# Altium project PROC154E3_SCH.PrjPcb (part 47 of 60)
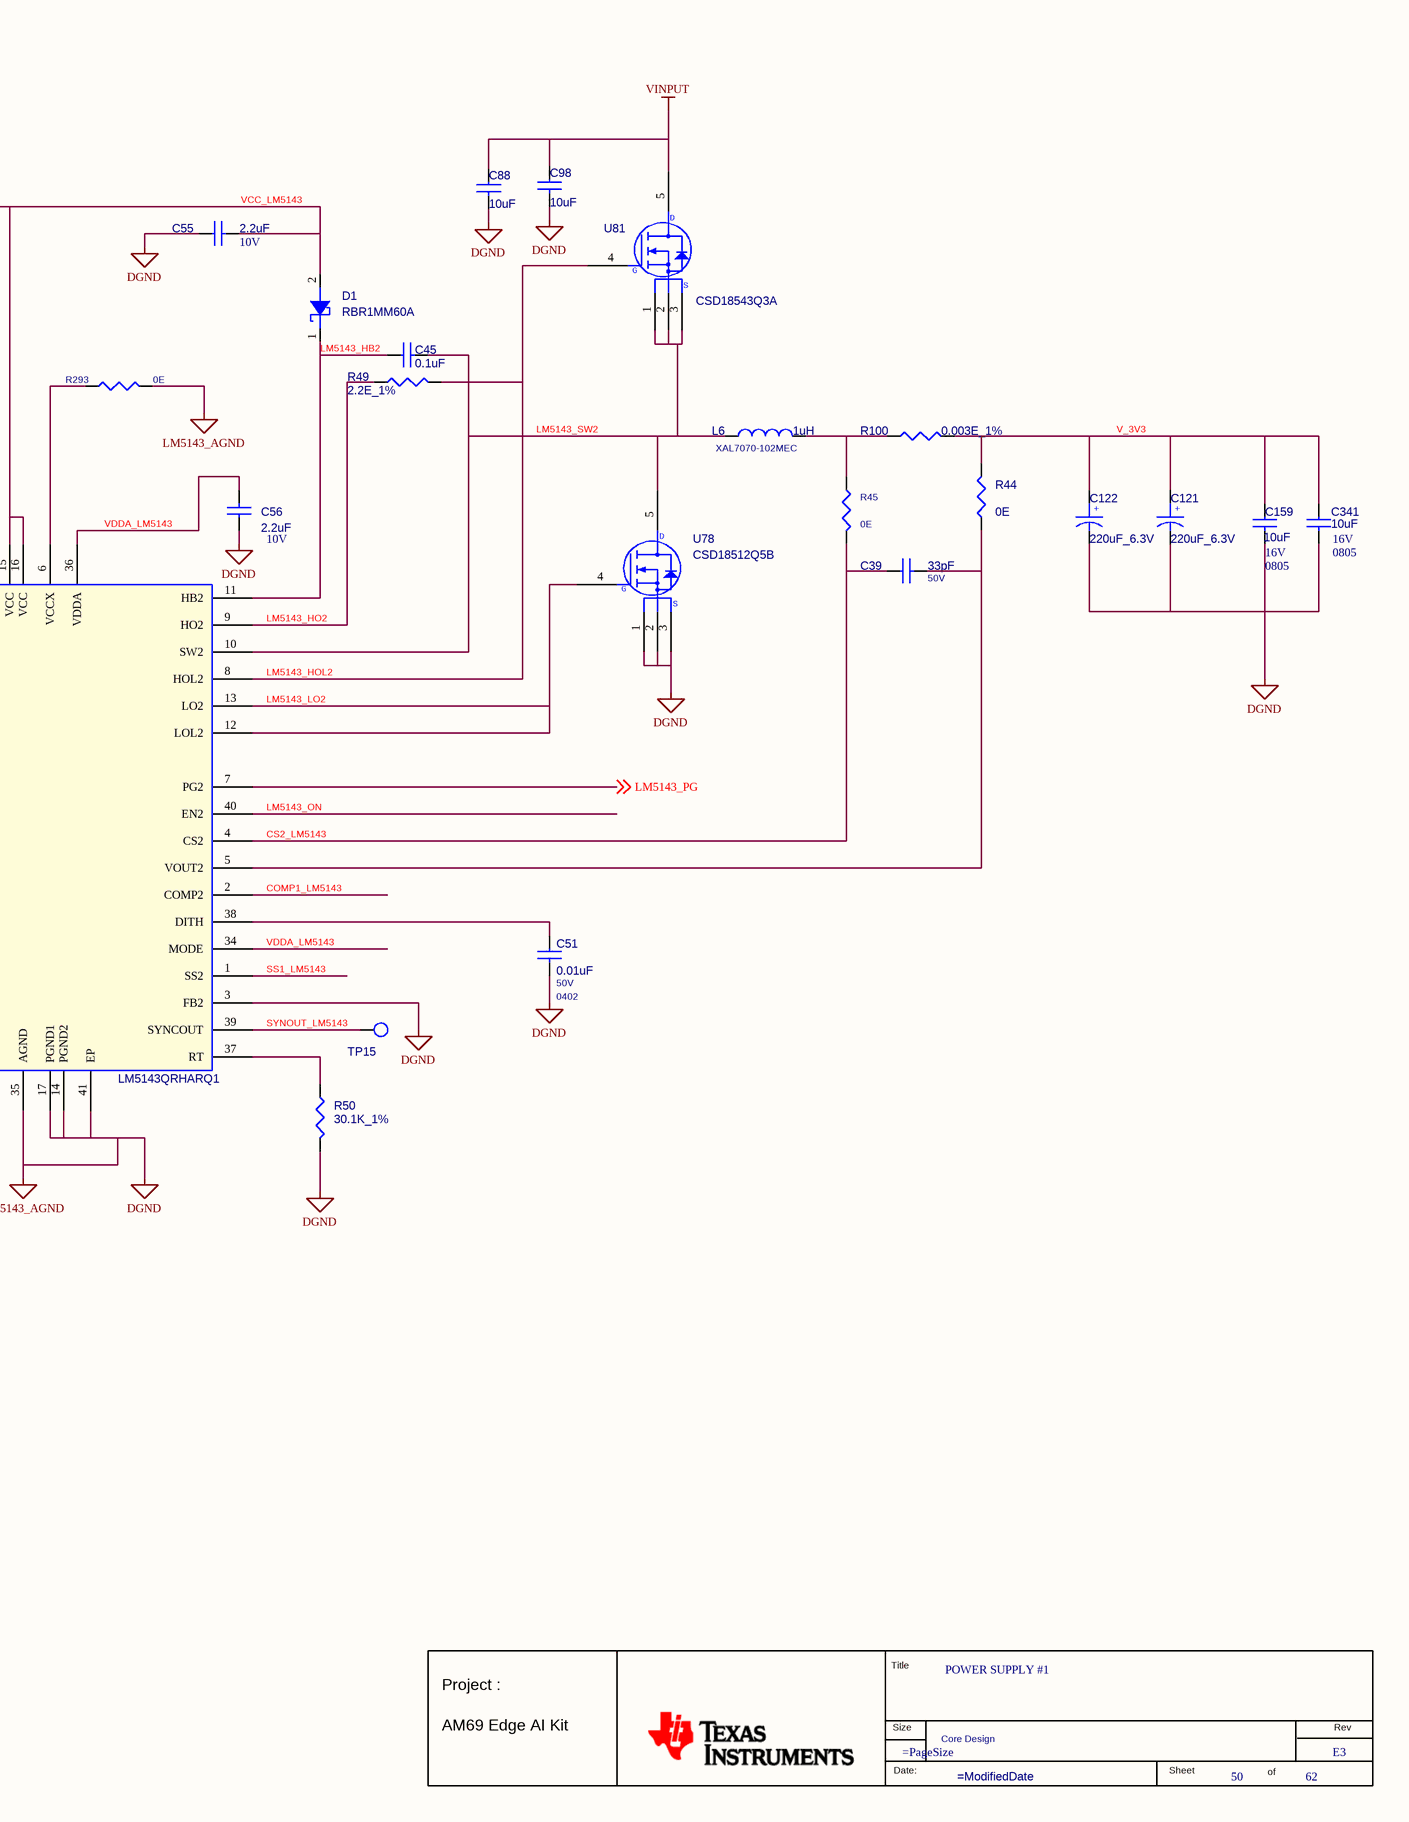
[diagram p185: 50. POWER SUPPLY #1.SchDoc, right]

## Sheet 50. POWER SUPPLY #1.SchDoc: POWER SUPPLY #1 (continued)

### Library data of the parts
*#50 = MISTRAL_TITLEBLK_CSIZE_1: as *#49 on sheet 49. POWER INPUT; Page Create Date: March  8, 1995; Page Size: =PageSize; Page Modify Date: =ModifiedDate; Schematic Page Count: 62; Schematic Page Number: 50
C36 = CAP_Dup1: CAP CERAMIC 1000pF 50V 5% C0G(NP0) 0402; Part Reference: C36; Part_type: CAPACITORS\CERAMIC; Mfr_part_number: 04025A102JAT2A; Mfr_name: AVX CORPORATION; Mistral Part No: 120016110009-R; Custom_Duty: 15%; Customs_HS_Code: 85322990; Wattage: NA; Project: BLR-3 PSPU; Value: 1000pF; PCB Footprint: CAP0402_0-75; Footprint Path: Y:\MIS_DATABASE\Library\ALTIUM_TOOL\PCB_FOOTPRINTS\Altium_Footprint_Lib.PcbLib; Library Path: Y:\MIS_DATABASE\Library\ALTIUM_TOOL\SCHEMATICS_PARTS\MS_DISCRETE_Library.schlib; MECHANICAL 3D STEP FILE: CAP0402_0-75; Chkd/date: VASANTHA/231216; Crtd /date: GEETHA/220906; Datasheet: Y:\MIS_DATABASE\DATASHEETS\CAPACITORS\AVX_MLC.PDF; Temperature: -55°C+125°C; Weight: 0.65mg; Height: 0.56MM; Library Ref: CAP; Distributor_part_number: 478-10070-1-ND; Distributor_name: DIGIKEY; Package: 0402; Voltage: 50V; Tolerance: 5%; Footprint Ref: CAP0402_0-75
C39 = CAP_Dup1: CAP CERAMIC 33pF 50V 5% C0G(NP0) 0402; Part Reference: C39; Mistral Part No: 120009030395-R; Mfr_name: MURATA; Mfr_part_number: GRM1555C1H330JZ01D; Part_type: CAPACITORS\CERAMIC; Project: ACRO_DM3730; Wattage: NA; Customs_HS_Code: 85322990; Custom_Duty: 15%; Value: 33pF; Footprint Path: Y:\MIS_DATABASE\Library\ALTIUM_TOOL\PCB_FOOTPRINTS\Altium_Footprint_Lib.PcbLib; Library Path: Y:\MIS_DATABASE\Library\ALTIUM_TOOL\SCHEMATICS_PARTS\MS_DISCRETE_Library.schlib; Footprint Ref: CAP0402_0-75; Tolerance: 5%; Package: 0402; Distributor_name: DIGIKEY; Distributor_part_number: 490-3220-1-ND; Library Ref: CAP; Height: 0.55MM; Weight: 6mg; Temperature: -55°C+125°C; Datasheet: Y:\MIS_DATABASE\DATASHEETS\CAPACITORS\MURATA-GXX-SER_NOV17.PDF; Crtd /date: BAVISH/080611; Chkd/date: NAVEED/260814; MECHANICAL 3D STEP FILE: CAP0402_0-75; Manufacturer: MURATA; PCB Footprint: CAP0402_0-75
C42 = CAP_Dup1: CAP CERAMIC 68pF 50V 5% C0G(NP0) 0402; Part Reference: C42; Mistral Part No: 120009050012-R; Mfr_name: KEMET; Mfr_part_number: C0402C680J5GACTU; Part_type: CAPACITORS\CERAMIC; Project: NARL_DRSP_4CH; Wattage: NA; Customs_HS_Code: 85322990; Custom_Duty: 15%; Value: 68pF; PCB Footprint: CAP0402_0-75; Footprint Ref: CAP0402_0-75; Tolerance: 5%; Voltage: 50V; Package: 0402; Distributor_name: DIGIKEY; Distributor_part_number: 399-7806-1-ND; Library Ref: CAP; Height: 0.55MM; Weight: 0.65mg; Temperature: -55°C+125°C; Datasheet: Y:\MIS_DATABASE\DATASHEETS\CAPACITORS\C0402C680J5GACTU.PDF; Crtd /date: MANIRAJA/210818; Chkd/date: MANIRAJA/210818; MECHANICAL 3D STEP FILE: CAP0402_0-75; Library Path: Y:\MIS_DATABASE\Library\ALTIUM_TOOL\SCHEMATICS_PARTS\MS_DISCRETE_Library.schlib; Footprint Path: Y:\MIS_DATABASE\Library\ALTIUM_TOOL\PCB_FOOTPRINTS\Altium_Footprint_Lib.PcbLib
C45 = CAP_Dup1: CAP CERAMIC 0.1uF 50V 10% X7R 0402; Part Reference: C45; Part_type: CAPACITORS\CERAMIC; Mfr_part_number: GRM155R71H104KE14D; Mfr_name: MURATA; Mistral Part No: 120011100014-R; Direct Alternate_mfr_name: TDK; Direct Alternate_mfr_part_number: C1005X7R1H104K050BE; Automotive Alternate_mfr_part_number: CGA2B3X7R1H104K050BB; Custom_Duty: 15%; Customs_HS_Code: 85322990; Wattage: NA; Project: J7_CP; Value: 0.1uF; Footprint Path: Y:\MIS_DATABASE\Library\ALTIUM_TOOL\PCB_FOOTPRINTS\Altium_Footprint_Lib.PcbLib; Library Path: Y:\MIS_DATABASE\Library\ALTIUM_TOOL\SCHEMATICS_PARTS\MS_DISCRETE_Library.schlib; MECHANICAL 3D STEP FILE: CAP0402_0-75; Chkd/date: MANIRAJA/261020; Crtd /date: ALVY/211020; Datasheet: Y:\MIS_DATABASE\DATASHEETS\CAPACITORS\GRM155R71H104KE14.PDF; Temperature: -55°C+125°C; Weight: 3.1mg; Height: 0.55MM; Distributor_part_number: 490-10700-1-ND; Distributor_name: DIGIKEY; Package: 0402; Voltage: 50V; Tolerance: 10%; Library Ref: CAP; Footprint Ref: CAP0402_0-75; Automotive Alternate_mfr_name: TDK; Manufacturer: MURATA; PCB Footprint: CAP0402_0-75
C51 = CAP_Dup1: CAP CERAMIC 0.01uF 50V 10% X7R 0402; Part Reference: C51; Mistral Part No: 120009030025-R; Mfr_name: KEMET; Mfr_part_number: C0402C103K5RACTU; Part_type: CAPACITORS\CERAMIC; Direct Alternate_mfr_name: TDK; Direct Alternate_mfr_part_number: C1005X7R1H103K050BE; Automotive Alternate_mfr_part_number: CGA2B3X7R1H103K050BB; Project: G4_SVGA; Customs_HS_Code: 85322990; Custom_Duty: 15%; Wattage: NA; Value: 0.01uF; PCB Footprint: CAP0402_0-75; Tolerance: 10%; Distributor_name: DIGIKEY; Distributor_part_number: 399-3066-1-ND; Library Ref: CAP; Height: 0.55MM; Datasheet: Y:\MIS_DATABASE\DATASHEETS\CAPACITORS\KEMET-C-X7R.PDF; Crtd /date: MAZHAR/040505; Chkd/date: SHREESHAIL/301105; Footprint Ref: CAP0402_0-75; Weight: 0.65mg; Temperature: -55°C+125°C; MECHANICAL 3D STEP FILE: CAP0402_0-75; Library Path: Y:\MIS_DATABASE\Library\ALTIUM_TOOL\SCHEMATICS_PARTS\MS_DISCRETE_Library.schlib; Footprint Path: Y:\MIS_DATABASE\Library\ALTIUM_TOOL\PCB_FOOTPRINTS\Altium_Footprint_Lib.PcbLib; Automotive Alternate_mfr_name: TDK
C55 = CAP_Dup1: CAP CERAMIC 2.2uF 10V 10% X7S 0603; Part Reference: C55; Mistral Part No: 120022090022-R; Mfr_name: MURATA; Mfr_part_number: GCM188C71A225KE01; Part_type: CAPACITORS\CERAMIC; Direct Alternate_mfr_name: YAGEO AMERICA; Direct Alternate_mfr_part_number: CC0402KRX5R7BB105; Automotive Alternate_mfr_name: TAIYO YUDEN; Automotive Alternate_mfr_part_number: EMK105BJ105KVHF; Manufacturer: TDK CORPORATION; Project: J7AHP_SK_BRD; Customs_HS_Code: 85322990; Custom_Duty: 15%; Wattage: NA; Value: 2.2uF; PCB Footprint: CAP0603_1; Tolerance: 10%; Package: 0603; Distributor_name: NA; Distributor_part_number: NA; Library Ref: CAP; Height: 0.90MM; Datasheet: Y:\MIS_DATABASE\DATASHEETS\CAPACITORS\GCM188C71A225KE01.PDF; Crtd /date: PRAVEEN/160922; Chkd/date: PRAVEEN/160922; Footprint Ref: CAP0603_1; Weight: 6.3mg; Temperature: -55°C+125°C; MECHANICAL 3D STEP FILE: CAP0603_1; Library Path: Y:\MIS_DATABASE\Library\ALTIUM_TOOL\SCHEMATICS_PARTS\MS_DISCRETE_Library.schlib; Footprint Path: Y:\MIS_DATABASE\Library\ALTIUM_TOOL\PCB_FOOTPRINTS\Altium_Footprint_Lib.PcbLib
C56 = CAP_Dup1: CAP CERAMIC 2.2uF 10V 10% X7S 0603; Part Reference: C56; Mistral Part No: 120022090022-R; Mfr_name: MURATA; Mfr_part_number: GCM188C71A225KE01; Part_type: CAPACITORS\CERAMIC; Direct Alternate_mfr_name: YAGEO AMERICA; Direct Alternate_mfr_part_number: CC0402KRX5R7BB105; Automotive Alternate_mfr_name: TAIYO YUDEN; Automotive Alternate_mfr_part_number: EMK105BJ105KVHF; Manufacturer: TDK CORPORATION; Project: J7AHP_SK_BRD; Customs_HS_Code: 85322990; Custom_Duty: 15%; Wattage: NA; Value: 2.2uF; PCB Footprint: CAP0603_1; Tolerance: 10%; Package: 0603; Distributor_name: NA; Distributor_part_number: NA; Library Ref: CAP; Height: 0.90MM; Datasheet: Y:\MIS_DATABASE\DATASHEETS\CAPACITORS\GCM188C71A225KE01.PDF; Crtd /date: PRAVEEN/160922; Chkd/date: PRAVEEN/160922; Footprint Ref: CAP0603_1; Weight: 6.3mg; Temperature: -55°C+125°C; MECHANICAL 3D STEP FILE: CAP0603_1; Library Path: Y:\MIS_DATABASE\Library\ALTIUM_TOOL\SCHEMATICS_PARTS\MS_DISCRETE_Library.schlib; Footprint Path: Y:\MIS_DATABASE\Library\ALTIUM_TOOL\PCB_FOOTPRINTS\Altium_Footprint_Lib.PcbLib
C57 = CAP_POL: CAP TANTALUM 220uF 6.3V 20% ESR 7mE V7343; Part Reference: C57; Part_type: CAPACITORS\TANTALUM; Mfr_part_number: T520V227M006ATE007; Mfr_name: KEMET; Mistral Part No: 120020100006-R; Custom_Duty: 15%; Customs_HS_Code: 85322990; Wattage: NA; Project: VAGG_SBC_BRD; Value: 220uF_6.3V; PCB Footprint: CAPT7343V_2; Footprint Path: Y:\MIS_DATABASE\Library\ALTIUM_TOOL\PCB_FOOTPRINTS\Altium_Footprint_Lib.PcbLib; Library Path: Y:\MIS_DATABASE\Library\ALTIUM_TOOL\SCHEMATICS_PARTS\MS_DISCRETE_Library.schlib; MECHANICAL 3D STEP FILE: CAPT7343V_2; Chkd/date: MANIRAJA/081020; Crtd /date: ALVY/081020; Datasheet: Y:\MIS_DATABASE\DATASHEETS\CAPACITORS\KEMET_T52X,530_MAY18.PDF; Temperature: -55°C+105°C; Weight: 274.3mg; Height: 1.90MM; Library Ref: CAP_POL; Distributor_part_number: 399-4659-1-ND; Distributor_name: DIGIKEY; Package: V7343; Voltage: 6.3V; Tolerance: 20%; Footprint Ref: CAPT7343V_2
C58 = CAP_POL: CAP TANTALUM 220uF 6.3V 20% ESR 7mE V7343; Part Reference: C58; Part_type: CAPACITORS\TANTALUM; Mfr_part_number: T520V227M006ATE007; Mfr_name: KEMET; Mistral Part No: 120020100006-R; Custom_Duty: 15%; Customs_HS_Code: 85322990; Wattage: NA; Project: VAGG_SBC_BRD; Value: 220uF_6.3V; PCB Footprint: CAPT7343V_2; Footprint Path: Y:\MIS_DATABASE\Library\ALTIUM_TOOL\PCB_FOOTPRINTS\Altium_Footprint_Lib.PcbLib; Library Path: Y:\MIS_DATABASE\Library\ALTIUM_TOOL\SCHEMATICS_PARTS\MS_DISCRETE_Library.schlib; MECHANICAL 3D STEP FILE: CAPT7343V_2; Chkd/date: MANIRAJA/081020; Crtd /date: ALVY/081020; Datasheet: Y:\MIS_DATABASE\DATASHEETS\CAPACITORS\KEMET_T52X,530_MAY18.PDF; Temperature: -55°C+105°C; Weight: 274.3mg; Height: 1.90MM; Library Ref: CAP_POL; Distributor_part_number: 399-4659-1-ND; Distributor_name: DIGIKEY; Package: V7343; Voltage: 6.3V; Tolerance: 20%; Footprint Ref: CAPT7343V_2
C59 = CAP_Dup1: CAP CERAMIC 2.2uF 10V 10% X7S 0603; Part Reference: C59; Part_type: CAPACITORS\CERAMIC; Mfr_part_number: GCM188C71A225KE01; Mfr_name: MURATA; Mistral Part No: 120022090022-R; Direct Alternate_mfr_name: YAGEO AMERICA; Direct Alternate_mfr_part_number: CC0402KRX5R7BB105; Automotive Alternate_mfr_name: TAIYO YUDEN; Automotive Alternate_mfr_part_number: EMK105BJ105KVHF; Manufacturer: TDK CORPORATION; Custom_Duty: 15%; Customs_HS_Code: 85322990; Project: J7AHP_SK_BRD; Wattage: NA; Value: 2.2uF; PCB Footprint: CAP0603_1; Chkd/date: PRAVEEN/160922; Crtd /date: PRAVEEN/160922; Datasheet: Y:\MIS_DATABASE\DATASHEETS\CAPACITORS\GCM188C71A225KE01.PDF; Height: 0.90MM; Library Ref: CAP; Distributor_part_number: NA; Distributor_name: NA; Package: 0603; Tolerance: 10%; Footprint Ref: CAP0603_1; Weight: 6.3mg; Temperature: -55°C+125°C; MECHANICAL 3D STEP FILE: CAP0603_1; Library Path: Y:\MIS_DATABASE\Library\ALTIUM_TOOL\SCHEMATICS_PARTS\MS_DISCRETE_Library.schlib; Footprint Path: Y:\MIS_DATABASE\Library\ALTIUM_TOOL\PCB_FOOTPRINTS\Altium_Footprint_Lib.PcbLib
C60 = CAP_Dup1: CAP CERAMIC 1uF 10V 10% X7S AUTO 0402; Part Reference: C60; Manufacturer: TDK CORPORATION; Automotive Alternate_mfr_part_number: EMK105BJ105KVHF; Automotive Alternate_mfr_name: TAIYO YUDEN; Direct Alternate_mfr_part_number: CC0402KRX5R7BB105; Direct Alternate_mfr_name: YAGEO AMERICA; Part_type: CAPACITORS\CERAMIC; Mfr_part_number: GCM155C71A105KE38D; Mfr_name: MURATA; Mistral Part No: 120018090021-R; Custom_Duty: 15%; Customs_HS_Code: 85322990; Wattage: NA; Project: SMART-M_SCRIPTALK_PB; Value: 1uF; PCB Footprint: CAP0402_0-75; MECHANICAL 3D STEP FILE: CAP0402_0-75; Library Ref: CAP; Chkd/date: MANIRAJA/100918; Crtd /date: ALVY/100918; Datasheet: Y:\MIS_DATABASE\DATASHEETS\CAPACITORS\MURATA-GCM-SER.PDF; Temperature: -55°C+125°C; Weight: 6mg; Height: 0.70MM; Distributor_part_number: 490-13409-1-ND; Distributor_name: DIGIKEY; Package: 0402; Tolerance: 10%; Footprint Ref: CAP0402_0-75; Library Path: Y:\MIS_DATABASE\Library\ALTIUM_TOOL\SCHEMATICS_PARTS\MS_DISCRETE_Library.schlib; Footprint Path: Y:\MIS_DATABASE\Library\ALTIUM_TOOL\PCB_FOOTPRINTS\Altium_Footprint_Lib.PcbLib
C62 = CAP_Dup1: CAP CERAMIC 33pF 50V 5% C0G(NP0) 0402; Part Reference: C62; Part_type: CAPACITORS\CERAMIC; Mfr_part_number: GRM1555C1H330JZ01D; Mfr_name: MURATA; Mistral Part No: 120009030395-R; Custom_Duty: 15%; Customs_HS_Code: 85322990; Wattage: NA; Project: ACRO_DM3730; Value: 33pF; MECHANICAL 3D STEP FILE: CAP0402_0-75; Chkd/date: NAVEED/260814; Crtd /date: BAVISH/080611; Datasheet: Y:\MIS_DATABASE\DATASHEETS\CAPACITORS\MURATA-GXX-SER_NOV17.PDF; Temperature: -55°C+125°C; Weight: 6mg; Height: 0.55MM; Library Ref: CAP; Distributor_part_number: 490-3220-1-ND; Distributor_name: DIGIKEY; Package: 0402; Tolerance: 5%; Footprint Ref: CAP0402_0-75; Library Path: Y:\MIS_DATABASE\Library\ALTIUM_TOOL\SCHEMATICS_PARTS\MS_DISCRETE_Library.schlib; Footprint Path: Y:\MIS_DATABASE\Library\ALTIUM_TOOL\PCB_FOOTPRINTS\Altium_Footprint_Lib.PcbLib; Manufacturer: MURATA; PCB Footprint: CAP0402_0-75
C63 = CAP_Dup1: CAP CERAMIC 0.1uF 50V 10% X7R 0402; Part Reference: C63; Manufacturer: MURATA; Mistral Part No: 120011100014-R; Mfr_part_number: GRM155R71H104KE14D; Part_type: CAPACITORS\CERAMIC; Direct Alternate_mfr_name: TDK; Direct Alternate_mfr_part_number: C1005X7R1H104K050BE; Automotive Alternate_mfr_part_number: CGA2B3X7R1H104K050BB; Project: J7_CP; Wattage: NA; Customs_HS_Code: 85322990; Custom_Duty: 15%; Value: 0.1uF; PCB Footprint: CAP0402_0-75; Footprint Ref: CAP0402_0-75; Library Ref: CAP; Mfr_name: MURATA; Tolerance: 10%; Package: 0402; Distributor_name: DIGIKEY; Distributor_part_number: 490-10700-1-ND; Height: 0.55MM; Weight: 3.1mg; Temperature: -55°C+125°C; Datasheet: Y:\MIS_DATABASE\DATASHEETS\CAPACITORS\GRM155R71H104KE14.PDF; Crtd /date: ALVY/211020; Chkd/date: MANIRAJA/261020; MECHANICAL 3D STEP FILE: CAP0402_0-75; Library Path: Y:\MIS_DATABASE\Library\ALTIUM_TOOL\SCHEMATICS_PARTS\MS_DISCRETE_Library.schlib; Footprint Path: Y:\MIS_DATABASE\Library\ALTIUM_TOOL\PCB_FOOTPRINTS\Altium_Footprint_Lib.PcbLib; Automotive Alternate_mfr_name: TDK
C64 = CAP_Dup1: CAP CERAMIC 0.1uF 50V 10% X7R 0402; Part Reference: C64; Part_type: CAPACITORS\CERAMIC; Mfr_part_number: GRM155R71H104KE14D; Manufacturer: MURATA; Mistral Part No: 120011100014-R; Custom_Duty: 15%; Customs_HS_Code: 85322990; Wattage: NA; Project: J7_CP; Value: 0.1uF; PCB Footprint: CAP0402_0-75; Footprint Path: Y:\MIS_DATABASE\Library\ALTIUM_TOOL\PCB_FOOTPRINTS\Altium_Footprint_Lib.PcbLib; Library Path: Y:\MIS_DATABASE\Library\ALTIUM_TOOL\SCHEMATICS_PARTS\MS_DISCRETE_Library.schlib; MECHANICAL 3D STEP FILE: CAP0402_0-75; Chkd/date: MANIRAJA/261020; Crtd /date: ALVY/211020; Datasheet: Y:\MIS_DATABASE\DATASHEETS\CAPACITORS\GRM155R71H104KE14.PDF; Temperature: -55°C+125°C; Weight: 3.1mg; Height: 0.55MM; Library Ref: CAP; Distributor_part_number: 490-10700-1-ND; Distributor_name: DIGIKEY; Package: 0402; Voltage: 50V; Tolerance: 10%; Footprint Ref: CAP0402_0-75; Mfr_name: MURATA
C75 = CAP_Dup1: CAP CERAMIC 10uF 50V 10% X7R 2220; Part Reference: C75; Part_type: CAPACITORS\CERAMIC; Mfr_part_number: C5750X7R1H106K; Mfr_name: TDK CORPORATION; Mistral Part No: 120009090017-R; Custom_Duty: 15%; Customs_HS_Code: 85322990; Wattage: NA; Project: ICD_DF_SYSTEM; Value: 10uF; PCB Footprint: CAP2220_2-5; Footprint Path: Y:\MIS_DATABASE\Library\ALTIUM_TOOL\PCB_FOOTPRINTS\Altium_Footprint_Lib.PcbLib; Library Path: Y:\MIS_DATABASE\Library\ALTIUM_TOOL\SCHEMATICS_PARTS\MS_DISCRETE_Library.schlib; MECHANICAL 3D STEP FILE: CAP2220_2-5; Chkd/date: RAGESH/270910; Crtd /date: MAZHAR/170909; Datasheet: Y:\MIS_DATABASE\DATASHEETS\CAPACITORS\TDK_C-SERIES.PDF; Temperature: -55°C+125°C; Weight: 480mg; Height: 2.50MM; Library Ref: CAP; Distributor_part_number: 445-3492-1-ND; Distributor_name: DIGIKEY; Package: 2220; Voltage: 50V; Tolerance: 10%; Footprint Ref: CAP2220_2-5
C76 = CAP_Dup1: CAP CERAMIC 10uF 50V 10% X7R 2220; Part Reference: C76; Mistral Part No: 120009090017-R; Mfr_name: TDK CORPORATION; Mfr_part_number: C5750X7R1H106K; Part_type: CAPACITORS\CERAMIC; Project: ICD_DF_SYSTEM; Wattage: NA; Customs_HS_Code: 85322990; Custom_Duty: 15%; Value: 10uF; PCB Footprint: CAP2220_2-5; Footprint Ref: CAP2220_2-5; Tolerance: 10%; Voltage: 50V; Package: 2220; Distributor_name: DIGIKEY; Distributor_part_number: 445-3492-1-ND; Library Ref: CAP; Height: 2.50MM; Weight: 480mg; Temperature: -55°C+125°C; Datasheet: Y:\MIS_DATABASE\DATASHEETS\CAPACITORS\TDK_C-SERIES.PDF; Crtd /date: MAZHAR/170909; Chkd/date: RAGESH/270910; MECHANICAL 3D STEP FILE: CAP2220_2-5; Library Path: Y:\MIS_DATABASE\Library\ALTIUM_TOOL\SCHEMATICS_PARTS\MS_DISCRETE_Library.schlib; Footprint Path: Y:\MIS_DATABASE\Library\ALTIUM_TOOL\PCB_FOOTPRINTS\Altium_Footprint_Lib.PcbLib
C88 = CAP_Dup1: CAP CERAMIC 10uF 50V 10% X7R 2220; Part Reference: C88; Part_type: CAPACITORS\CERAMIC; Mfr_part_number: C5750X7R1H106K; Mfr_name: TDK CORPORATION; Mistral Part No: 120009090017-R; Custom_Duty: 15%; Customs_HS_Code: 85322990; Wattage: NA; Project: ICD_DF_SYSTEM; Value: 10uF; PCB Footprint: CAP2220_2-5; Footprint Path: Y:\MIS_DATABASE\Library\ALTIUM_TOOL\PCB_FOOTPRINTS\Altium_Footprint_Lib.PcbLib; Library Path: Y:\MIS_DATABASE\Library\ALTIUM_TOOL\SCHEMATICS_PARTS\MS_DISCRETE_Library.schlib; MECHANICAL 3D STEP FILE: CAP2220_2-5; Chkd/date: RAGESH/270910; Crtd /date: MAZHAR/170909; Datasheet: Y:\MIS_DATABASE\DATASHEETS\CAPACITORS\TDK_C-SERIES.PDF; Temperature: -55°C+125°C; Weight: 480mg; Height: 2.50MM; Library Ref: CAP; Distributor_part_number: 445-3492-1-ND; Distributor_name: DIGIKEY; Package: 2220; Voltage: 50V; Tolerance: 10%; Footprint Ref: CAP2220_2-5
C98 = CAP_Dup1: CAP CERAMIC 10uF 50V 10% X7R 2220; Part Reference: C98; Part_type: CAPACITORS\CERAMIC; Mfr_part_number: C5750X7R1H106K; Mfr_name: TDK CORPORATION; Mistral Part No: 120009090017-R; Custom_Duty: 15%; Customs_HS_Code: 85322990; Wattage: NA; Project: ICD_DF_SYSTEM; Value: 10uF; PCB Footprint: CAP2220_2-5; Footprint Path: Y:\MIS_DATABASE\Library\ALTIUM_TOOL\PCB_FOOTPRINTS\Altium_Footprint_Lib.PcbLib; Library Path: Y:\MIS_DATABASE\Library\ALTIUM_TOOL\SCHEMATICS_PARTS\MS_DISCRETE_Library.schlib; MECHANICAL 3D STEP FILE: CAP2220_2-5; Chkd/date: RAGESH/270910; Crtd /date: MAZHAR/170909; Datasheet: Y:\MIS_DATABASE\DATASHEETS\CAPACITORS\TDK_C-SERIES.PDF; Temperature: -55°C+125°C; Weight: 480mg; Height: 2.50MM; Library Ref: CAP; Distributor_part_number: 445-3492-1-ND; Distributor_name: DIGIKEY; Package: 2220; Voltage: 50V; Tolerance: 10%; Footprint Ref: CAP2220_2-5
C121 = CAP_POL: CAP TANTALUM 220uF 6.3V 20% ESR 7mE V7343; Part Reference: C121; Mistral Part No: 120020100006-R; Mfr_name: KEMET; Mfr_part_number: T520V227M006ATE007; Part_type: CAPACITORS\TANTALUM; Project: VAGG_SBC_BRD; Wattage: NA; Customs_HS_Code: 85322990; Custom_Duty: 15%; Value: 220uF_6.3V; PCB Footprint: CAPT7343V_2; Footprint Ref: CAPT7343V_2; Tolerance: 20%; Voltage: 6.3V; Package: V7343; Distributor_name: DIGIKEY; Distributor_part_number: 399-4659-1-ND; Library Ref: CAP_POL; Height: 1.90MM; Weight: 274.3mg; Temperature: -55°C+105°C; Datasheet: Y:\MIS_DATABASE\DATASHEETS\CAPACITORS\KEMET_T52X,530_MAY18.PDF; Crtd /date: ALVY/081020; Chkd/date: MANIRAJA/081020; MECHANICAL 3D STEP FILE: CAPT7343V_2; Library Path: Y:\MIS_DATABASE\Library\ALTIUM_TOOL\SCHEMATICS_PARTS\MS_DISCRETE_Library.schlib; Footprint Path: Y:\MIS_DATABASE\Library\ALTIUM_TOOL\PCB_FOOTPRINTS\Altium_Footprint_Lib.PcbLib
C122 = CAP_POL: CAP TANTALUM 220uF 6.3V 20% ESR 7mE V7343; Part Reference: C122; Mistral Part No: 120020100006-R; Mfr_name: KEMET; Mfr_part_number: T520V227M006ATE007; Part_type: CAPACITORS\TANTALUM; Project: VAGG_SBC_BRD; Wattage: NA; Customs_HS_Code: 85322990; Custom_Duty: 15%; Value: 220uF_6.3V; PCB Footprint: CAPT7343V_2; Footprint Ref: CAPT7343V_2; Tolerance: 20%; Voltage: 6.3V; Package: V7343; Distributor_name: DIGIKEY; Distributor_part_number: 399-4659-1-ND; Library Ref: CAP_POL; Height: 1.90MM; Weight: 274.3mg; Temperature: -55°C+105°C; Datasheet: Y:\MIS_DATABASE\DATASHEETS\CAPACITORS\KEMET_T52X,530_MAY18.PDF; Crtd /date: ALVY/081020; Chkd/date: MANIRAJA/081020; MECHANICAL 3D STEP FILE: CAPT7343V_2; Library Path: Y:\MIS_DATABASE\Library\ALTIUM_TOOL\SCHEMATICS_PARTS\MS_DISCRETE_Library.schlib; Footprint Path: Y:\MIS_DATABASE\Library\ALTIUM_TOOL\PCB_FOOTPRINTS\Altium_Footprint_Lib.PcbLib
C158 = CAP_Dup1: CAP CERAMIC 10uF 16V 10% X5R 0805; Part Reference: C158; Manufacturer: MURATA; Automotive Alternate_mfr_part_number: GCM21BR71A106KE22L; Direct Alternate_mfr_part_number: CL21B106KPQNNNE; Direct Alternate_mfr_name: SAMSUNG; Part_type: CAPACITORS\CERAMIC; Mfr_part_number: GRM21BR61C106KE15L; Mistral Part No: 120009030205-R; Custom_Duty: 15%; Customs_HS_Code: 85322990; Project: VOCERA; Wattage: NA; Value: 10uF; PCB Footprint: CAP0805_1-5; Automotive Alternate_mfr_name: MURATA; Chkd/date: SHREESHAIL/220506; Crtd /date: MAZHAR/150506; Datasheet: Y:\MIS_DATABASE\DATASHEETS\CAPACITORS\MURATA-GXX-SER_NOV17.PDF; Temperature: -55°C+85°C; Weight: 9.5mg; Height: 1.35MM; Library Ref: CAP; Distributor_part_number: 490-3886-1-ND; Distributor_name: DIGIKEY; Tolerance: 10%; Mfr_name: MURATA; Footprint Ref: CAP0805_1-5; MECHANICAL 3D STEP FILE: CAP0805_1-5; Library Path: Y:\MIS_DATABASE\Library\ALTIUM_TOOL\SCHEMATICS_PARTS\MS_DISCRETE_Library.schlib; Footprint Path: Y:\MIS_DATABASE\Library\ALTIUM_TOOL\PCB_FOOTPRINTS\Altium_Footprint_Lib.PcbLib
C159 = CAP_Dup1: CAP CERAMIC 10uF 16V 10% X5R 0805; Part Reference: C159; Manufacturer: MURATA; Automotive Alternate_mfr_part_number: GCM21BR71A106KE22L; Direct Alternate_mfr_part_number: CL21B106KPQNNNE; Direct Alternate_mfr_name: SAMSUNG; Part_type: CAPACITORS\CERAMIC; Mfr_part_number: GRM21BR61C106KE15L; Mistral Part No: 120009030205-R; Custom_Duty: 15%; Customs_HS_Code: 85322990; Project: VOCERA; Wattage: NA; Value: 10uF; PCB Footprint: CAP0805_1-5; Automotive Alternate_mfr_name: MURATA; Chkd/date: SHREESHAIL/220506; Crtd /date: MAZHAR/150506; Datasheet: Y:\MIS_DATABASE\DATASHEETS\CAPACITORS\MURATA-GXX-SER_NOV17.PDF; Temperature: -55°C+85°C; Weight: 9.5mg; Height: 1.35MM; Library Ref: CAP; Distributor_part_number: 490-3886-1-ND; Distributor_name: DIGIKEY; Tolerance: 10%; Mfr_name: MURATA; Footprint Ref: CAP0805_1-5; MECHANICAL 3D STEP FILE: CAP0805_1-5; Library Path: Y:\MIS_DATABASE\Library\ALTIUM_TOOL\SCHEMATICS_PARTS\MS_DISCRETE_Library.schlib; Footprint Path: Y:\MIS_DATABASE\Library\ALTIUM_TOOL\PCB_FOOTPRINTS\Altium_Footprint_Lib.PcbLib
C341 = CAP_Dup1: CAP CERAMIC 10uF 16V 10% X5R 0805; Part Reference: C341; Manufacturer: MURATA; Automotive Alternate_mfr_part_number: GCM21BR71A106KE22L; Direct Alternate_mfr_part_number: CL21B106KPQNNNE; Direct Alternate_mfr_name: SAMSUNG; Part_type: CAPACITORS\CERAMIC; Mfr_part_number: GRM21BR61C106KE15L; Mistral Part No: 120009030205-R; Custom_Duty: 15%; Customs_HS_Code: 85322990; Project: VOCERA; Wattage: NA; Value: 10uF; PCB Footprint: CAP0805_1-5; Automotive Alternate_mfr_name: MURATA; Chkd/date: SHREESHAIL/220506; Crtd /date: MAZHAR/150506; Datasheet: Y:\MIS_DATABASE\DATASHEETS\CAPACITORS\MURATA-GXX-SER_NOV17.PDF; Temperature: -55°C+85°C; Weight: 9.5mg; Height: 1.35MM; Library Ref: CAP; Distributor_part_number: 490-3886-1-ND; Distributor_name: DIGIKEY; Tolerance: 10%; Mfr_name: MURATA; Footprint Ref: CAP0805_1-5; MECHANICAL 3D STEP FILE: CAP0805_1-5; Library Path: Y:\MIS_DATABASE\Library\ALTIUM_TOOL\SCHEMATICS_PARTS\MS_DISCRETE_Library.schlib; Footprint Path: Y:\MIS_DATABASE\Library\ALTIUM_TOOL\PCB_FOOTPRINTS\Altium_Footprint_Lib.PcbLib
C342 = CAP_Dup1: CAP CERAMIC 10uF 16V 10% X5R 0805; Part Reference: C342; Mistral Part No: 120009030205-R; Mfr_name: MURATA; Mfr_part_number: GRM21BR61C106KE15L; Part_type: CAPACITORS\CERAMIC; Direct Alternate_mfr_name: SAMSUNG; Direct Alternate_mfr_part_number: CL21B106KPQNNNE; Automotive Alternate_mfr_part_number: GCM21BR71A106KE22L; Wattage: NA; Project: VOCERA; Customs_HS_Code: 85322990; Custom_Duty: 15%; Value: 10uF; PCB Footprint: CAP0805_1-5; Footprint Path: Y:\MIS_DATABASE\Library\ALTIUM_TOOL\PCB_FOOTPRINTS\Altium_Footprint_Lib.PcbLib; Library Path: Y:\MIS_DATABASE\Library\ALTIUM_TOOL\SCHEMATICS_PARTS\MS_DISCRETE_Library.schlib; MECHANICAL 3D STEP FILE: CAP0805_1-5; Footprint Ref: CAP0805_1-5; Tolerance: 10%; Distributor_name: DIGIKEY; Distributor_part_number: 490-3886-1-ND; Library Ref: CAP; Height: 1.35MM; Weight: 9.5mg; Temperature: -55°C+85°C; Datasheet: Y:\MIS_DATABASE\DATASHEETS\CAPACITORS\MURATA-GXX-SER_NOV17.PDF; Crtd /date: MAZHAR/150506; Chkd/date: SHREESHAIL/220506; Automotive Alternate_mfr_name: MURATA; Manufacturer: MURATA
D1 = DIODE_SCHOTTKY: DIODE SCHOTTKY RECTIFIER 60V 1A SOD-123FL; Part Reference: D1; Part_type: DIODE\SCHOTTKY; Mfr_part_number: RBR1MM60ATR; Mfr_name: ROHM; Mistral Part No: 130022030051-R; Custom_Duty: 15%; Customs_HS_Code: 85412900; Wattage: NA; Project: TI_J7AHP_EVM_BRD; Value: RBR1MM60A; Footprint Path: Y:\MIS_DATABASE\Library\ALTIUM_TOOL\PCB_FOOTPRINTS\Altium_Footprint_Lib.PcbLib; Library Path: Y:\MIS_DATABASE\Library\ALTIUM_TOOL\SCHEMATICS_PARTS\MS_DISCRETE_Library.schlib; MECHANICAL 3D STEP FILE: DIO_SOD123F_0-9; Chkd/date: ALVY/240322; Crtd /date: TAMILARASU/220322; Datasheet: Y:\MIS_DATABASE\DATASHEETS\DISCRETES\DIODES\RBR1MM60A.PDF; Temperature: NA; Weight: 27.827mg; Height: 0.90MM; Library Ref: DIODE_SCHOTTKY; Distributor_part_number: RBR1MM60ACT-ND; Distributor_name: DIGIKEY; Package: SOD-123FL; Voltage: 60V; Tolerance: NA; Footprint Ref: DIO_SOD123F_0-9; Manufacturer: ROHM; PCB Footprint: DIO_SOD123F_0-9
D2 = DIODE_SCHOTTKY: DIODE SCHOTTKY RECTIFIER 60V 1A SOD-123FL; Part Reference: D2; Manufacturer: ROHM; Mistral Part No: 130022030051-R; Mfr_part_number: RBR1MM60ATR; Part_type: DIODE\SCHOTTKY; Project: TI_J7AHP_EVM_BRD; Tolerance: NA; Customs_HS_Code: 85412900; Custom_Duty: 15%; Value: RBR1MM60A; Footprint Ref: DIO_SOD123F_0-9; Mfr_name: ROHM; Voltage: 60V; Wattage: NA; Package: SOD-123FL; Distributor_name: DIGIKEY; Distributor_part_number: RBR1MM60ACT-ND; Library Ref: DIODE_SCHOTTKY; Height: 0.90MM; Weight: 27.827mg; Temperature: NA; Datasheet: Y:\MIS_DATABASE\DATASHEETS\DISCRETES\DIODES\RBR1MM60A.PDF; Crtd /date: TAMILARASU/220322; Chkd/date: ALVY/240322; MECHANICAL 3D STEP FILE: DIO_SOD123F_0-9; Library Path: Y:\MIS_DATABASE\Library\ALTIUM_TOOL\SCHEMATICS_PARTS\MS_DISCRETE_Library.schlib; Footprint Path: Y:\MIS_DATABASE\Library\ALTIUM_TOOL\PCB_FOOTPRINTS\Altium_Footprint_Lib.PcbLib; PCB Footprint: DIO_SOD123F_0-9
L1 = INDUCTOR: IND POWER 1uH 34.8A 20% SMD; Part Reference: L1; Mistral Part No: 130023030034-R; Mfr_name: COIL CRAFT; Project: J7AHP_SK; Voltage: NA; Customs_HS_Code: 85437099; Custom_Duty: 24%; Value: 1uH; Chkd/date: PRAVEEN/200323; PCB Footprint: IND_XAL7070_300X310_SMD_7; Part_type: INDUCTOR; Tolerance: 20%; Wattage: NA; Package: SMD; Distributor_name: MOUSER; Distributor_part_number: 994-XAL7070-102MEC; Library Ref: INDUCTOR; Footprint Ref: IND_XAL7070_300X310_SMD_7; Height: 7.00MM; Weight: 2100mg; Temperature: -40°C+125°C; Datasheet: Y:\MIS_DATABASE\DATASHEETS\DISCRETES\INDUCTORS\XAL7070_JUN19.PDF; Crtd /date: PRAVEEN/200323; MECHANICAL 3D STEP FILE: IND_XAL7070_300X310_SMD_7; Library Path: Y:\MIS_DATABASE\Library\ALTIUM_TOOL\SCHEMATICS_PARTS\MS_DISCRETE_Library.schlib; Footprint Path: Y:\MIS_DATABASE\Library\ALTIUM_TOOL\PCB_FOOTPRINTS\Altium_Footprint_Lib.PcbLib
L6 = INDUCTOR: IND POWER 1uH 34.8A 20% SMD; Part Reference: L6; Mistral Part No: 130023030034-R; Mfr_name: COIL CRAFT; Project: J7AHP_SK; Voltage: NA; Customs_HS_Code: 85437099; Custom_Duty: 24%; Value: 1uH; Chkd/date: PRAVEEN/200323; PCB Footprint: IND_XAL7070_300X310_SMD_7; Part_type: INDUCTOR; Tolerance: 20%; Wattage: NA; Package: SMD; Distributor_name: MOUSER; Distributor_part_number: 994-XAL7070-102MEC; Library Ref: INDUCTOR; Footprint Ref: IND_XAL7070_300X310_SMD_7; Height: 7.00MM; Weight: 2100mg; Temperature: -40°C+125°C; Datasheet: Y:\MIS_DATABASE\DATASHEETS\DISCRETES\INDUCTORS\XAL7070_JUN19.PDF; Crtd /date: PRAVEEN/200323; MECHANICAL 3D STEP FILE: IND_XAL7070_300X310_SMD_7; Library Path: Y:\MIS_DATABASE\Library\ALTIUM_TOOL\SCHEMATICS_PARTS\MS_DISCRETE_Library.schlib; Footprint Path: Y:\MIS_DATABASE\Library\ALTIUM_TOOL\PCB_FOOTPRINTS\Altium_Footprint_Lib.PcbLib
R44 = RESISTOR_Dup2: RES 0E 1/10W JUMPER 0402; Part Reference: R44; Mistral Part No: 110018030052-R; Mfr_name: PANASONIC-ECG; Mfr_part_number: ERJ-2GE0R00X; Part_type: RESISTORS\FIXED; Project: AEGIS POM; Tolerance: NA; Customs_HS_Code: 85332119; Custom_Duty: 15%; IBISSP_MODLES: VALUE REPEATING 2 TIME; Value: 0E; Library Ref: RESISTOR; Voltage: NA; Wattage: 1/10W; Package: 0402; Distributor_name: DIGIKEY; Distributor_part_number: P0.0JCT-ND; Height: 0.40MM; Weight: 0.8mg; Temperature: -55°C+155°C; Datasheet: Y:\MIS_DATABASE\DATASHEETS\RESISTORS\PAN-ERJSER_NOV17.PDF; Crtd /date: NAVEED/201014; Chkd/date: VASANTHA/061216; MECHANICAL 3D STEP FILE: RES0402_0-5; Footprint Ref: RES0402_0-5; Library Path: Y:\MIS_DATABASE\Library\ALTIUM_TOOL\SCHEMATICS_PARTS\MS_DISCRETE_Library.schlib; Footprint Path: Y:\MIS_DATABASE\Library\ALTIUM_TOOL\PCB_FOOTPRINTS\Altium_Footprint_Lib.PcbLib; Manufacturer: PANASONIC-ECG; PCB Footprint: RES0402_0-5
R45 = RESISTOR: RES 0E 1/10W JUMPER 0402; Part Reference: R45; Mistral Part No: 110018030052-R; Mfr_name: PANASONIC-ECG; Mfr_part_number: ERJ-2GE0R00X; Part_type: RESISTORS\FIXED; Project: AEGIS POM; Tolerance: NA; Customs_HS_Code: 85332119; Custom_Duty: 15%; IBISSP_MODLES: VALUE REPEATING 2 TIME; Value: 0E; Voltage: NA; Wattage: 1/10W; Package: 0402; Distributor_name: DIGIKEY; Distributor_part_number: P0.0JCT-ND; Height: 0.40MM; Weight: 0.8mg; Temperature: -55°C+155°C; Datasheet: Y:\MIS_DATABASE\DATASHEETS\RESISTORS\PAN-ERJSER_NOV17.PDF; Crtd /date: NAVEED/201014; Chkd/date: VASANTHA/061216; MECHANICAL 3D STEP FILE: RES0402_0-5; Library Path: Y:\MIS_DATABASE\Library\ALTIUM_TOOL\SCHEMATICS_PARTS\MS_DISCRETE_Library.schlib; Footprint Path: Y:\MIS_DATABASE\Library\ALTIUM_TOOL\PCB_FOOTPRINTS\Altium_Footprint_Lib.PcbLib; Library Ref: RESISTOR; Footprint Ref: RES0402_0-5; Manufacturer: PANASONIC-ECG; PCB Footprint: RES0402_0-5
R47 = RESISTOR_Dup2: RES 0.003E 1W 1% 1206; Part Reference: R47; Part_type: RESISTORS\FIXED; Mfr_part_number: CSNL1206FT3L00; Mfr_name: STACKPOLE ELECTRONICS; Mistral Part No: 110018090032-R; Custom_Duty: 15%; Customs_HS_Code: 85332119; Voltage: NA; Project: TI_J7ES_EVM_CP; Value: 0.003E_1%; PCB Footprint: RES1206_1; Footprint Path: Y:\MIS_DATABASE\Library\ALTIUM_TOOL\PCB_FOOTPRINTS\Altium_Footprint_Lib.PcbLib; Library Path: Y:\MIS_DATABASE\Library\ALTIUM_TOOL\SCHEMATICS_PARTS\MS_DISCRETE_Library.schlib; MECHANICAL 3D STEP FILE: RES1206_1; Chkd/date: MANIRAJA/280918; Crtd /date: ALVY/280918; Datasheet: Y:\MIS_DATABASE\DATASHEETS\RESISTORS\CSNL-SERIES.PDF; Temperature: -55°C+170°C; Weight: NA; Height: 0.90MM; Library Ref: RESISTOR; Distributor_part_number: CSNL1206FT3L00CT-ND; Distributor_name: DIGIKEY; Package: 1206; Wattage: 1W; Tolerance: 1%; Footprint Ref: RES1206_1
R48 = RESISTOR_Dup2: RES 22.6K 1/16W 1% 0402; Part Reference: R48; Part_type: RESISTORS\FIXED; Mfr_part_number: CRCW040222K6FKED; Mfr_name: VISHAY; Mistral Part No: 110010020002-R; Custom_Duty: 15%; Customs_HS_Code: 85332119; Voltage: NA; Project: OMAPL138; Value: 22.6K_1%; PCB Footprint: RES0402_0-5; Footprint Path: Y:\MIS_DATABASE\Library\ALTIUM_TOOL\PCB_FOOTPRINTS\Altium_Footprint_Lib.PcbLib; Library Path: Y:\MIS_DATABASE\Library\ALTIUM_TOOL\SCHEMATICS_PARTS\MS_DISCRETE_Library.schlib; MECHANICAL 3D STEP FILE: RES0402_0-5; Chkd/date: MAZHAR/030210; Crtd /date: MUDDU/030210; Datasheet: Y:\MIS_DATABASE\DATASHEETS\RESISTORS\CRCW0603.PDF; Temperature: -55°C+155°C; Weight: 0.65mg; Height: 0.40MM; Library Ref: RESISTOR; Distributor_part_number: 541-22.6KLCT-ND; Distributor_name: DIGIKEY; Package: 0402; Wattage: 1/16W; Tolerance: 1%; Footprint Ref: RES0402_0-5
R49 = RESISTOR_Dup2: RES 2.2E 1/16W 1% 0402; Part Reference: R49; Mistral Part No: 110022090018-R; Mfr_name: YAGEO AMERICA; Mfr_part_number: RC0402FR-072R2L; Part_type: RESISTORS\FIXED; Project: J7AHP_SK_BRD; Voltage: NA; Customs_HS_Code: 85332119; Custom_Duty: 15%; Value: 2.2E_1%; Footprint Ref: RES0402_0-5; Tolerance: 1%; Wattage: 1/16W; Package: 0402; Distributor_name: DIGIKEY; Distributor_part_number: 311-2.20LRCT-ND; Library Ref: RESISTOR; Height: 0.40MM; Weight: 0.65mg; Temperature: -55°C+155°C; Datasheet: Y:\MIS_DATABASE\DATASHEETS\RESISTORS\RCXXXXL-SER_MAR18.PDF; Crtd /date: PRAVEEN/160922; Chkd/date: PRAVEEN/160922; MECHANICAL 3D STEP FILE: RES0402_0-5; Library Path: Y:\MIS_DATABASE\Library\ALTIUM_TOOL\SCHEMATICS_PARTS\MS_DISCRETE_Library.schlib; Footprint Path: Y:\MIS_DATABASE\Library\ALTIUM_TOOL\PCB_FOOTPRINTS\Altium_Footprint_Lib.PcbLib; PCB Footprint: RES0402_0-5
R50 = RESISTOR_Dup2: RES 30.1K 1/16W 1% 0402; Part Reference: R50; Mfr_name: VISHAY; Mistral Part No: 110009030648-R; Mfr_part_number: CRCW040230K1FKEDC; Part_type: RESISTORS\FIXED; Project: TI_AM335x SK_BRD; Voltage: NA; Customs_HS_Code: 85332119; Custom_Duty: 15%; Value: 30.1K_1%; Footprint Ref: RES0402_0-5; Manufacturer: VISHAY; Tolerance: 1%; Wattage: 1/16W; Package: 0402; Distributor_name: DIGIKEY; Distributor_part_number: 541-4109-1-ND; Library Ref: RESISTOR; Height: 0.35MM; Weight: 0.65mg; Temperature: -55°C+155°C; Datasheet: Y:\MIS_DATABASE\DATASHEETS\RESISTORS\CRCW_C-SER.PDF; Crtd /date: ALVY/280921; Chkd/date: MANIRAJA/290921; MECHANICAL 3D STEP FILE: RES0402_0-5; Library Path: Y:\MIS_DATABASE\Library\ALTIUM_TOOL\SCHEMATICS_PARTS\MS_DISCRETE_Library.schlib; Footprint Path: Y:\MIS_DATABASE\Library\ALTIUM_TOOL\PCB_FOOTPRINTS\Altium_Footprint_Lib.PcbLib; PCB Footprint: RES0402_0-5
R55 = RESISTOR_Dup2: RES 2.2E 1/16W 1% 0402; Part Reference: R55; Mistral Part No: 110022090018-R; Mfr_name: YAGEO AMERICA; Mfr_part_number: RC0402FR-072R2L; Part_type: RESISTORS\FIXED; Project: J7AHP_SK_BRD; Voltage: NA; Customs_HS_Code: 85332119; Custom_Duty: 15%; Value: 2.2E_1%; Footprint Ref: RES0402_0-5; Tolerance: 1%; Wattage: 1/16W; Package: 0402; Distributor_name: DIGIKEY; Distributor_part_number: 311-2.20LRCT-ND; Library Ref: RESISTOR; Height: 0.40MM; Weight: 0.65mg; Temperature: -55°C+155°C; Datasheet: Y:\MIS_DATABASE\DATASHEETS\RESISTORS\RCXXXXL-SER_MAR18.PDF; Crtd /date: PRAVEEN/160922; Chkd/date: PRAVEEN/160922; MECHANICAL 3D STEP FILE: RES0402_0-5; Library Path: Y:\MIS_DATABASE\Library\ALTIUM_TOOL\SCHEMATICS_PARTS\MS_DISCRETE_Library.schlib; Footprint Path: Y:\MIS_DATABASE\Library\ALTIUM_TOOL\PCB_FOOTPRINTS\Altium_Footprint_Lib.PcbLib; PCB Footprint: RES0402_0-5
R69 = RESISTOR_Dup2: RES 0E 1/10W JUMPER 0402; Part Reference: R69; Part_type: RESISTORS\FIXED; Mfr_part_number: ERJ-2GE0R00X; Mfr_name: PANASONIC-ECG; Mistral Part No: 110018030052-R; Custom_Duty: 15%; Customs_HS_Code: 85332119; Voltage: NA; Project: AEGIS POM; IBISSP_MODLES: VALUE REPEATING 2 TIME; Value: 0E; MECHANICAL 3D STEP FILE: RES0402_0-5; Chkd/date: VASANTHA/061216; Crtd /date: NAVEED/201014; Datasheet: Y:\MIS_DATABASE\DATASHEETS\RESISTORS\PAN-ERJSER_NOV17.PDF; Temperature: -55°C+155°C; Weight: 0.8mg; Height: 0.40MM; Distributor_part_number: P0.0JCT-ND; Distributor_name: DIGIKEY; Package: 0402; Wattage: 1/10W; Tolerance: NA; Library Ref: RESISTOR; Footprint Ref: RES0402_0-5; Library Path: Y:\MIS_DATABASE\Library\ALTIUM_TOOL\SCHEMATICS_PARTS\MS_DISCRETE_Library.schlib; Footprint Path: Y:\MIS_DATABASE\Library\ALTIUM_TOOL\PCB_FOOTPRINTS\Altium_Footprint_Lib.PcbLib; Manufacturer: PANASONIC-ECG; PCB Footprint: RES0402_0-5
R70 = RESISTOR: RES 0E 1/10W JUMPER 0402; Part Reference: R70; Part_type: RESISTORS\FIXED; Mfr_part_number: ERJ-2GE0R00X; Mfr_name: PANASONIC-ECG; Mistral Part No: 110018030052-R; Custom_Duty: 15%; Customs_HS_Code: 85332119; Voltage: NA; Project: AEGIS POM; IBISSP_MODLES: VALUE REPEATING 2 TIME; Value: 0E; Footprint Ref: RES0402_0-5; Library Ref: RESISTOR; Footprint Path: Y:\MIS_DATABASE\Library\ALTIUM_TOOL\PCB_FOOTPRINTS\Altium_Footprint_Lib.PcbLib; Library Path: Y:\MIS_DATABASE\Library\ALTIUM_TOOL\SCHEMATICS_PARTS\MS_DISCRETE_Library.schlib; MECHANICAL 3D STEP FILE: RES0402_0-5; Chkd/date: VASANTHA/061216; Crtd /date: NAVEED/201014; Datasheet: Y:\MIS_DATABASE\DATASHEETS\RESISTORS\PAN-ERJSER_NOV17.PDF; Temperature: -55°C+155°C; Weight: 0.8mg; Height: 0.40MM; Distributor_part_number: P0.0JCT-ND; Distributor_name: DIGIKEY; Package: 0402; Wattage: 1/10W; Tolerance: NA; Manufacturer: PANASONIC-ECG; PCB Footprint: RES0402_0-5
R100 = RESISTOR_Dup2: RES 0.003E 1W 1% 1206; Part Reference: R100; Part_type: RESISTORS\FIXED; Mfr_part_number: CSNL1206FT3L00; Mfr_name: STACKPOLE ELECTRONICS; Mistral Part No: 110018090032-R; Custom_Duty: 15%; Customs_HS_Code: 85332119; Voltage: NA; Project: TI_J7ES_EVM_CP; Value: 0.003E_1%; PCB Footprint: RES1206_1; Footprint Path: Y:\MIS_DATABASE\Library\ALTIUM_TOOL\PCB_FOOTPRINTS\Altium_Footprint_Lib.PcbLib; Library Path: Y:\MIS_DATABASE\Library\ALTIUM_TOOL\SCHEMATICS_PARTS\MS_DISCRETE_Library.schlib; MECHANICAL 3D STEP FILE: RES1206_1; Chkd/date: MANIRAJA/280918; Crtd /date: ALVY/280918; Datasheet: Y:\MIS_DATABASE\DATASHEETS\RESISTORS\CSNL-SERIES.PDF; Temperature: -55°C+170°C; Weight: NA; Height: 0.90MM; Library Ref: RESISTOR; Distributor_part_number: CSNL1206FT3L00CT-ND; Distributor_name: DIGIKEY; Package: 1206; Wattage: 1W; Tolerance: 1%; Footprint Ref: RES1206_1
R293 = RESISTOR: RES 0E 1/10W JUMPER 0402; Part Reference: R293; Part_type: RESISTORS\FIXED; Mfr_part_number: ERJ-2GE0R00X; Mfr_name: PANASONIC-ECG; Mistral Part No: 110018030052-R; Custom_Duty: 15%; Customs_HS_Code: 85332119; Voltage: NA; Project: AEGIS POM; IBISSP_MODLES: VALUE REPEATING 2 TIME; Value: 0E; Footprint Path: Y:\MIS_DATABASE\Library\ALTIUM_TOOL\PCB_FOOTPRINTS\Altium_Footprint_Lib.PcbLib; Library Path: Y:\MIS_DATABASE\Library\ALTIUM_TOOL\SCHEMATICS_PARTS\MS_DISCRETE_Library.schlib; MECHANICAL 3D STEP FILE: RES0402_0-5; Chkd/date: VASANTHA/061216; Crtd /date: NAVEED/201014; Datasheet: Y:\MIS_DATABASE\DATASHEETS\RESISTORS\PAN-ERJSER_NOV17.PDF; Temperature: -55°C+155°C; Weight: 0.8mg; Height: 0.40MM; Library Ref: RESISTOR; Distributor_part_number: P0.0JCT-ND; Distributor_name: DIGIKEY; Package: 0402; Wattage: 1/10W; Tolerance: NA; Footprint Ref: RES0402_0-5; Manufacturer: PANASONIC-ECG; PCB Footprint: RES0402_0-5
R316 = RESISTOR_Dup2: RES 10K 1/16W 5% 0402; Part Reference: R316; Mistral Part No: 110011060021-R; Mfr_name: YAGEO AMERICA; Mfr_part_number: RC0402JR-0710KL; Part_type: RESISTORS\FIXED; Project: HSE; Voltage: NA; Customs_HS_Code: 85332119; Custom_Duty: 15%; Value: 10K; MECHANICAL 3D STEP FILE: RES0402_0-5; Tolerance: 5%; Wattage: 1/16W; Package: 0402; Distributor_name: DIGIKEY; Distributor_part_number: 311-10KJRCT-ND; Height: 0.40MM; Weight: 0.65mg; Temperature: -55°C+155°C; Datasheet: Y:\MIS_DATABASE\DATASHEETS\RESISTORS\RCXXXXL-SER_MAR18.PDF; Crtd /date: MAZHAR/230805; Chkd/date: VASANTHA/061216; Library Ref: RESISTOR; Footprint Ref: RES0402_0-5; Library Path: Y:\MIS_DATABASE\Library\ALTIUM_TOOL\SCHEMATICS_PARTS\MS_DISCRETE_Library.schlib; Footprint Path: Y:\MIS_DATABASE\Library\ALTIUM_TOOL\PCB_FOOTPRINTS\Altium_Footprint_Lib.PcbLib; Manufacturer: YAGEO AMERICA; PCB Footprint: RES0402_0-5
R326 = RESISTOR: RES 0E 1/10W JUMPER 0402; Part Reference: R326; Manufacturer: PANASONIC-ECG; Mistral Part No: 110018030052-R; Mfr_part_number: ERJ-2GE0R00X; Part_type: RESISTORS\FIXED; IBISSP_MODLES: VALUE REPEATING 2 TIME; Project: AEGIS POM; Tolerance: NA; Customs_HS_Code: 85332119; Custom_Duty: 15%; Value: 0E; Mfr_name: PANASONIC-ECG; Voltage: NA; Wattage: 1/10W; Package: 0402; Distributor_name: DIGIKEY; Distributor_part_number: P0.0JCT-ND; Height: 0.40MM; Weight: 0.8mg; Temperature: -55°C+155°C; Datasheet: Y:\MIS_DATABASE\DATASHEETS\RESISTORS\PAN-ERJSER_NOV17.PDF; Crtd /date: NAVEED/201014; Chkd/date: VASANTHA/061216; MECHANICAL 3D STEP FILE: RES0402_0-5; Library Path: Y:\MIS_DATABASE\Library\ALTIUM_TOOL\SCHEMATICS_PARTS\MS_DISCRETE_Library.schlib; Footprint Path: Y:\MIS_DATABASE\Library\ALTIUM_TOOL\PCB_FOOTPRINTS\Altium_Footprint_Lib.PcbLib; Library Ref: RESISTOR; Footprint Ref: RES0402_0-5; PCB Footprint: RES0402_0-5
R327 = RESISTOR_Dup2: RES 10K 1/16W 5% 0402; Part Reference: R327; Mistral Part No: 110011060021-R; Mfr_name: YAGEO AMERICA; Mfr_part_number: RC0402JR-0710KL; Part_type: RESISTORS\FIXED; Project: HSE; Voltage: NA; Customs_HS_Code: 85332119; Custom_Duty: 15%; Value: 10K; MECHANICAL 3D STEP FILE: RES0402_0-5; Tolerance: 5%; Wattage: 1/16W; Package: 0402; Distributor_name: DIGIKEY; Distributor_part_number: 311-10KJRCT-ND; Height: 0.40MM; Weight: 0.65mg; Temperature: -55°C+155°C; Datasheet: Y:\MIS_DATABASE\DATASHEETS\RESISTORS\RCXXXXL-SER_MAR18.PDF; Crtd /date: MAZHAR/230805; Chkd/date: VASANTHA/061216; Library Ref: RESISTOR; Footprint Ref: RES0402_0-5; Library Path: Y:\MIS_DATABASE\Library\ALTIUM_TOOL\SCHEMATICS_PARTS\MS_DISCRETE_Library.schlib; Footprint Path: Y:\MIS_DATABASE\Library\ALTIUM_TOOL\PCB_FOOTPRINTS\Altium_Footprint_Lib.PcbLib; Manufacturer: YAGEO AMERICA; PCB Footprint: RES0402_0-5
R328 = RESISTOR_Dup2: RES 45K 1/16W 1% 0402; Part Reference: R328; Mistral Part No: 110019070005-R; Mfr_name: YAGEO AMERICA; Mfr_part_number: RC0402FR-0745KL; Part_type: RESISTORS\FIXED; Project: MYTHIC_FORMFACTOR_BRD; Voltage: NA; Customs_HS_Code: 85332119; Custom_Duty: 15%; Value: 45K_1%; Footprint Ref: RES0402_0-5; Tolerance: 1%; Wattage: 1/16W; Package: 0402; Distributor_name: DIGIKEY; Distributor_part_number: RC0402FR-0745KL-ND; Library Ref: RESISTOR; Height: 0.40MM; Weight: NA; Temperature: -55°C+155°C; Datasheet: Y:\MIS_DATABASE\DATASHEETS\RESISTORS\RCXXXXL-SER_MAR18.PDF; Crtd /date: ALVY/010719; Chkd/date: MANIRAJA/010719; MECHANICAL 3D STEP FILE: RES0402_0-5; Library Path: Y:\MIS_DATABASE\Library\ALTIUM_TOOL\SCHEMATICS_PARTS\MS_DISCRETE_Library.schlib; Footprint Path: Y:\MIS_DATABASE\Library\ALTIUM_TOOL\PCB_FOOTPRINTS\Altium_Footprint_Lib.PcbLib; PCB Footprint: RES0402_0-5
TP11 = TESTPOINT_Dup1: TESTPOINT 1.0MM DRILL PTH; Part Reference: TP11; Manufacturer: LOCAL; Mistral Part No: 130009030938; Project: HSE; Value: THRU HOLE; Datasheet: NA; Chkd/date: MAZHAR/271211; Crtd /date: SHREESHAIL/041005; Height: NA; Distributor_part_number: NA; Distributor_name: NA; Package: THRU-HOLE; Part_type: TESTPOINT; Mfr_part_number: TP_40X65; Mfr_name: LOCAL; Library Ref: TESTPOINT; PCB Footprint: TP_40X65
TP15 = TESTPOINT_Dup1: TESTPOINT CIR 30 SMD; Part Reference: TP15; Manufacturer: LOCAL; Mistral Part No: 130009030930; Project: BT MODULE_CSRBC04; Tolerance: NA; Value: TP30_SMD; RoHS: NA; Footprint Ref: TP30_SMD; Library Ref: TESTPOINT; Mfr_name: LOCAL; Mfr_part_number: TP30_SMD; Part_type: TESTPOINT; Voltage: NA; Wattage: NA; Package: SMD; Distributor_name: NA; Distributor_part_number: NA; Height: NA; Weight: NA; Temperature: NA; Datasheet: NA; Crtd /date: MAZHAR/171006; Chkd/date: SHREESHAIL/171006; MECHANICAL 3D STEP FILE: NA; Library Path: Y:\MIS_DATABASE\Library\ALTIUM_TOOL\SCHEMATICS_PARTS\MS_DISCRETE_Library.schlib; Footprint Path: Y:\MIS_DATABASE\Library\ALTIUM_TOOL\PCB_FOOTPRINTS\Altium_Footprint_Lib.PcbLib; Customs_HS_Code: NA; Custom_Duty: NA; PCB Footprint: TP30_SMD
TP67 = TESTPOINT_Dup1: TESTPOINT 1.0MM DRILL PTH; Part Reference: TP67; Manufacturer: LOCAL; Mistral Part No: 130009030938; Project: HSE; Value: THRU HOLE; Datasheet: NA; Chkd/date: MAZHAR/271211; Crtd /date: SHREESHAIL/041005; Height: NA; Distributor_part_number: NA; Distributor_name: NA; Package: THRU-HOLE; Part_type: TESTPOINT; Mfr_part_number: TP_40X65; Mfr_name: LOCAL; Library Ref: TESTPOINT; PCB Footprint: TP_40X65
TP84 = TESTPOINT_Dup1: TESTPOINT 1.0MM DRILL PTH; Part Reference: TP84; Manufacturer: LOCAL; Mistral Part No: 130009030938; Project: HSE; Value: THRU HOLE; Library Ref: TESTPOINT; Mfr_name: LOCAL; Mfr_part_number: TP_40X65; Part_type: TESTPOINT; Package: THRU-HOLE; Distributor_name: NA; Distributor_part_number: NA; Height: NA; Crtd /date: SHREESHAIL/041005; Chkd/date: MAZHAR/271211; Datasheet: NA; PCB Footprint: TP_40X65
U11 = LM5143-Q1_VQFNP40: IC 3.5V-65V DUAL SYNCHRONOUS BUCK DC/DC CONTROLLER WITH ULTRA-LOW IQ VQFNP40; Part Reference: U11; Part_type: ICS\POWER\CONTROL; Manufacturer: TEXAS INSTRUMENTS; Mistral Part No: 142022020015-R; Custom_Duty: 15%; Customs_HS_Code: 85423100; Wattage: NA; Project: TI_J7AHP_EVM_BRD; Value: LM5143QRHARQ1; Footprint Path: Y:\MIS_DATABASE\Library\ALTIUM_TOOL\PCB_FOOTPRINTS\Altium_Footprint_Lib.PcbLib; Library Path: Y:\MIS_DATABASE\Library\ALTIUM_TOOL\SCHEMATICS_PARTS\MS_MISCPOWER_Library.schlib; MECHANICAL 3D STEP FILE: QFN40_19-68_240X240_1_EP3-4; Chkd/date: MANIRAJA/110222; Crtd /date: ALVY/100222; Datasheet: Y:\MIS_DATABASE\DATASHEETS\ICS\POWER\LM5143.PDF; Temperature: -40°C+150°C; Weight: NA; Height: 1.00MM; Library Ref: LM5143-Q1_VQFNP40; Distributor_part_number: NA; Distributor_name: NA; Package: VQFNP40; Voltage: NA; Tolerance: NA; Mfr_part_number: LM5143QRHARQ1; Footprint Ref: QFN40_19-68_240X240_1_EP3-4; Mfr_name: TEXAS INSTRUMENTS; PCB Footprint: QFN40_19-68_240X240_1_EP3-4
U75 = MOSFET_CSD18501Q5A: IC MOSFET N-CHANNEL 60V VSONP8; Part Reference: U75; Part_type: ICS\POWER\MOSFET; Mfr_name: TEXAS INSTRUMENTS; Mistral Part No: 142017100004-R; Custom_Duty: 15%; Customs_HS_Code: 85423100; Wattage: NA; Project: TI_MAXIE_CPB; Value: CSD18543Q3A; Footprint Path: Y:\MIS_DATABASE\Library\ALTIUM_TOOL\PCB_FOOTPRINTS\Altium_Footprint_Lib.PcbLib; Library Path: Y:\MIS_DATABASE\Library\ALTIUM_TOOL\SCHEMATICS_PARTS\MS_MOSFET_Library.schlib; Chkd/date: MANIRAJA/041017; Crtd /date: MANIRAJA/041017; Datasheet: Y:\MIS_DATABASE\DATASHEETS\ICS\POWER\CSD18543Q3A.PDF; Temperature: -55°C+150°C; Weight: NA; Height: 0.90MM; Library Ref: MOSFET_CSD18501Q5A; Distributor_part_number: 296-47321-1-ND; Distributor_name: DIGIKEY; Package: VSONP8; Voltage: 60V; Tolerance: NA; Mfr_part_number: CSD18543Q3A; Footprint Ref: VSONP8_CSD18543Q_120X130_0-9; PCB Footprint: VSONP8_CSD18543Q_120X130_0-9; MECHANICAL 3D STEP FILE: VSONP8_CSD18543Q_120X130_0-9
U76 = MOSFET_CSD18501Q5A: IC 40V MOSFET N-CHANNEL NEXFET VSON8; Part Reference: U76; Mistral Part No: 142019110020-R; Mfr_name: TEXAS INSTRUMENTS; Part_type: ICS\POWER\MOSFET; Project: CLOUD RADAR_CONTROLLER-PS_BRD; Tolerance: NA; Customs_HS_Code: 85423100; Custom_Duty: 15%; Value: CSD18512Q5B; PCB Footprint: VSON8_CSD1850_240X200_1-1; Footprint Ref: VSON8_CSD1850_240X200_1-1; Mfr_part_number: CSD18512Q5B; Voltage: NA; Wattage: NA; Package: VSON8; Distributor_name: DIGIKEY; Distributor_part_number: 296-47756-1-ND; Library Ref: MOSFET_CSD18501Q5A; Height: 1.05MM; Weight: 115.7mg; Temperature: -55°C+150°C; Datasheet: Y:\MIS_DATABASE\DATASHEETS\ICS\POWER\CSD18512Q5B.PDF; Crtd /date: MANIRAJA/251119; Chkd/date: ALVY/261119; MECHANICAL 3D STEP FILE: VSON8_CSD1850_240X200_1-1; Library Path: Y:\MIS_DATABASE\Library\ALTIUM_TOOL\SCHEMATICS_PARTS\MS_MOSFET_Library.schlib; Footprint Path: Y:\MIS_DATABASE\Library\ALTIUM_TOOL\PCB_FOOTPRINTS\Altium_Footprint_Lib.PcbLib
U78 = MOSFET_CSD18501Q5A: IC 40V MOSFET N-CHANNEL NEXFET VSON8; Part Reference: U78; Mistral Part No: 142019110020-R; Mfr_name: TEXAS INSTRUMENTS; Part_type: ICS\POWER\MOSFET; Project: CLOUD RADAR_CONTROLLER-PS_BRD; Tolerance: NA; Customs_HS_Code: 85423100; Custom_Duty: 15%; Value: CSD18512Q5B; Footprint Ref: VSON8_CSD1850_240X200_1-1; Mfr_part_number: CSD18512Q5B; Voltage: NA; Wattage: NA; Package: VSON8; Distributor_name: DIGIKEY; Distributor_part_number: 296-47756-1-ND; Library Ref: MOSFET_CSD18501Q5A; PCB Footprint: VSON8_CSD1850_240X200_1-1; Height: 1.05MM; Weight: 115.7mg; Temperature: -55°C+150°C; Datasheet: Y:\MIS_DATABASE\DATASHEETS\ICS\POWER\CSD18512Q5B.PDF; Crtd /date: MANIRAJA/251119; Chkd/date: ALVY/261119; MECHANICAL 3D STEP FILE: VSON8_CSD1850_240X200_1-1; Library Path: Y:\MIS_DATABASE\Library\ALTIUM_TOOL\SCHEMATICS_PARTS\MS_MOSFET_Library.schlib; Footprint Path: Y:\MIS_DATABASE\Library\ALTIUM_TOOL\PCB_FOOTPRINTS\Altium_Footprint_Lib.PcbLib
U81 = MOSFET_CSD18501Q5A: IC MOSFET N-CHANNEL 60V VSONP8; Part Reference: U81; Part_type: ICS\POWER\MOSFET; Mfr_name: TEXAS INSTRUMENTS; Mistral Part No: 142017100004-R; Custom_Duty: 15%; Customs_HS_Code: 85423100; Wattage: NA; Project: TI_MAXIE_CPB; Value: CSD18543Q3A; Footprint Path: Y:\MIS_DATABASE\Library\ALTIUM_TOOL\PCB_FOOTPRINTS\Altium_Footprint_Lib.PcbLib; Library Path: Y:\MIS_DATABASE\Library\ALTIUM_TOOL\SCHEMATICS_PARTS\MS_MOSFET_Library.schlib; Chkd/date: MANIRAJA/041017; Crtd /date: MANIRAJA/041017; Datasheet: Y:\MIS_DATABASE\DATASHEETS\ICS\POWER\CSD18543Q3A.PDF; Temperature: -55°C+150°C; Weight: NA; Height: 0.90MM; Library Ref: MOSFET_CSD18501Q5A; Distributor_part_number: 296-47321-1-ND; Distributor_name: DIGIKEY; Package: VSONP8; Voltage: 60V; Tolerance: NA; Mfr_part_number: CSD18543Q3A; Footprint Ref: VSONP8_CSD18543Q_120X130_0-9; PCB Footprint: VSONP8_CSD18543Q_120X130_0-9; MECHANICAL 3D STEP FILE: VSONP8_CSD18543Q_120X130_0-9